# EAGLE schematic interaction_agronautes (EAGLE 6.1)
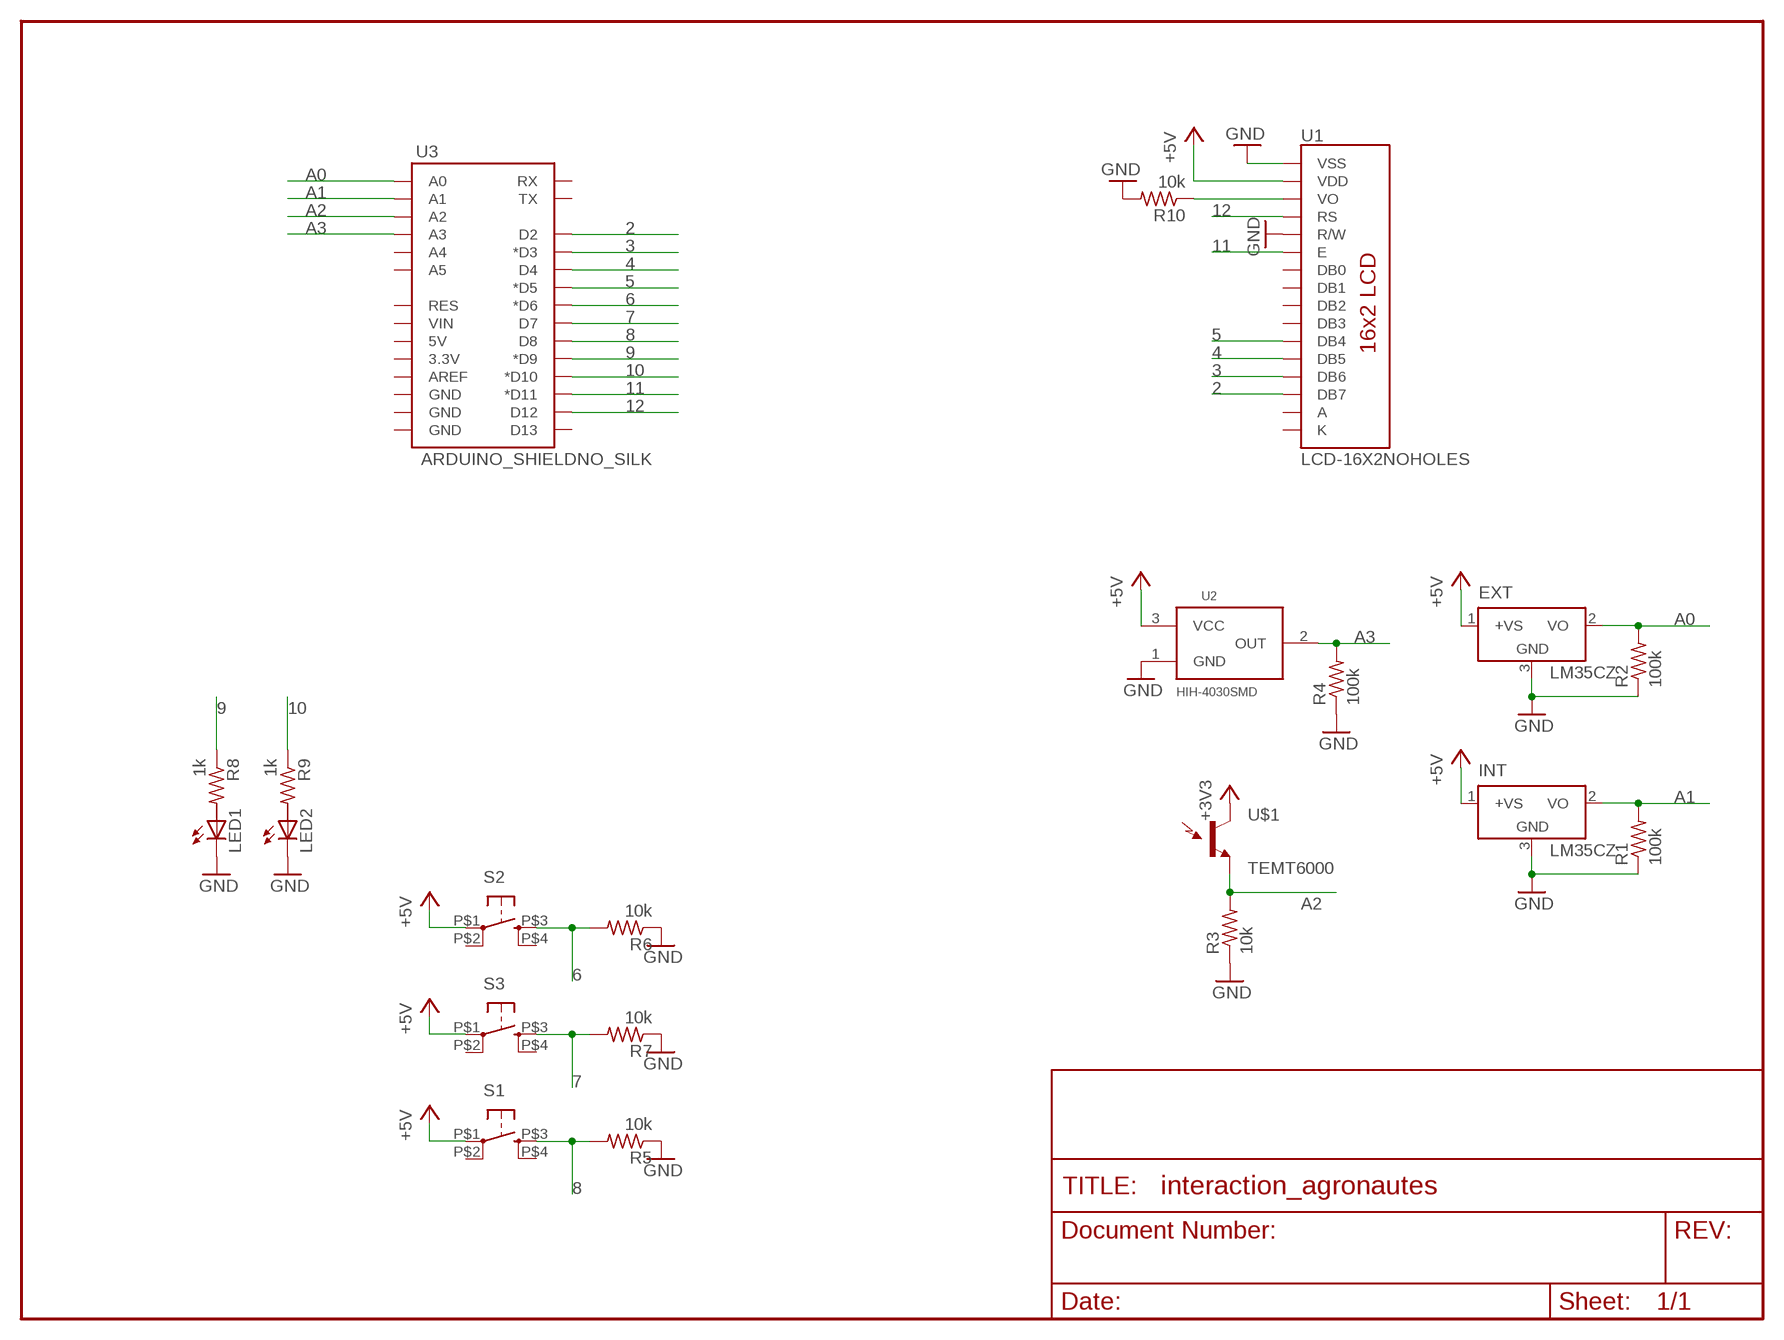
[diagram p0: schematic, sheet 1]

## Parts
EXT  LM35CZ  [TO92]
INT  LM35CZ  [TO92]
LED1  LED5MM  [LED5MM]
LED2  LED5MM  [LED5MM]
R1  100k  R-US_0204/7  [0204/7]
R2  100k  R-US_0204/7  [0204/7]
R3  10k  R-US_0204/7  [0204/7]
R4  100k  R-US_0204/7  [0204/7]
R5  10k  R-US_0204/7  [0204/7]
R6  10k  R-US_0204/7  [0204/7]
R7  10k  R-US_0204/7  [0204/7]
R8  1k  R-US_0204/7  [0204/7]
R9  1k  R-US_0204/7  [0204/7]
R10  10k  R-US_0204/7  [0204/7]
S1  TAC_SWITCHKSA_SEALED  [KSA_SEALED_TAC_SWITCH]
S2  TAC_SWITCHKSA_SEALED  [KSA_SEALED_TAC_SWITCH]
S3  TAC_SWITCHKSA_SEALED  [KSA_SEALED_TAC_SWITCH]
U1  LCD-16X2NOHOLES  [LCD-16X2_NOHOLES]
U2  HIH-4030SMD  [HIH-4030]
U3  ARDUINO_SHIELDNO_SILK  [DUEMILANOVE_VIAS]
U$1  TEMT6000  [TEMT6000-SEN]

## Nets
2: U1.14(DB7) U3.D2
3: U1.13(DB6) U3.D3(*D3)
4: U1.12(DB5) U3.D4
5: U1.11(DB4) U3.D5(*D5)
6: R6.2 S2.P$3 U3.D6(*D6)
7: R7.2 S3.P$3 U3.D7
8: R5.2 S1.P$3 U3.D8
9: R8.1 U3.D9(*D9)
10: R9.1 U3.D10(*D10)
11: U1.6(E) U3.D11(*D11)
12: U1.4(RS) U3.D12
+3V3: U$1.COLLECTOR(C1)
+5V: EXT.1(+VS) INT.1(+VS) S1.P$1 S2.P$1 S3.P$1 U1.2(VDD) U2.3(VCC)
A0: EXT.2(VO) R2.2 U3.A0
A1: INT.2(VO) R1.2 U3.A1
A2: R3.2 U3.A2 U$1.EMITTER(E1)
A3: R4.2 U2.2(OUT) U3.A3
GND: EXT.3(GND) INT.3(GND) LED1.K(C) LED2.K(C) R1.1 R2.1 R3.1 R4.1 R5.1 R6.1 R7.1 R10.2 U1.1(VSS) U1.5(R/W) U2.1(GND)
N$1: R10.1 U1.3(VO)
Unconnected: LED1.A LED2.A R8.2 R9.2 S1.P$2 S1.P$4 S2.P$2 S2.P$4 S3.P$2 S3.P$4 U1.7(DB0) U1.8(DB1) U1.9(DB2) U1.10(DB3) U3.3.3V U3.5V U3.A4 U3.A5 U3.AREF U3.D13 U3.GND@0(GND) U3.GND@1(GND) U3.GND@2(GND) U3.RES U3.RX U3.TX U3.VIN

## Power pins joined to a net without a drawn wire
A: U1.15(A)
K: U1.16(K)

## Library data of the parts
EXT INT = lm35:LM35: Single-Supply Centigrade Temperature Sensor Vout = (10mV/°C x Temp °C) +5mmmV Source: http://www.national.com/ds/LM/LM35.pdf
LED1 LED2 = led:LED: LED OSRAM: - CHIPLED LG R971, LG N971, LY N971, LG Q971, LY Q971, LO R971, LY R971 LH N974, LH R974 LS Q976, LO Q976, LY Q976 LO Q996 - Hyper CHIPLED LW Q18S LB Q993, LB Q99A, LB R99A - SideLED LS A670, LO A670, LY A670, LG A670, LP A670 LB A673, LV A673, LT A673, LW A673 LH A674 LY A675 LS A676, LA A676, LO A676, LY A676, LW A676 LS A679, LY A679, LG A679 - Hyper Micro SIDELED® LS Y876, LA Y876, LO Y876, LY Y876 LT Y87S - SmartLED LW L88C, LW L88S LB L89C, LB L89S, LG L890 LS L89K, LO L89K, LY L89K LS L896, LA L896, LO L896, LY L896 - TOPLED LS T670, LO T670, LY T670, LG T670, LP T670 LSG T670, LSP T670, LSY T670, LOP T670, LYG T670 LG T671, LOG T671, LSG T671 LB T673, LV T673, LT T673, LW T673 LH T674 LS T676, LA T676, LO T676, LY T676, LB T676, LH T676, LSB T676, LW T676 LB T67C, LV T67C, LT T67C, LS T67K, LO T67K, LY T67K, LW E67C LS E67B, LA E67B, LO E67B, LY E67B, LB E67C, LV E67C, LT E67C LW T67C LS T679, LY T679, LG T679 LS T770, LO T770, LY T770, LG T770, LP T770 LB T773, LV T773, LT T773, LW T773 LH T774 LS E675, LA E675, LY E675, LS T675 LS T776, LA T776, LO T776, LY T776, LB T776 LHGB T686 LT T68C, LB T68C - Hyper Mini TOPLED® LB M676 - Mini TOPLED Santana® LG M470 LS M47K, LO M47K, LY M47K Source: http://www.osram.convergy.de LUXEON: - LUMILED® LXK2-PW12-R00, LXK2-PW12-S00, LXK2-PW14-U00, LXK2-PW14-V00 LXK2-PM12-R00, LXK2-PM12-S00, LXK2-PM14-U00 LXK2-PE12-Q00, LXK2-PE12-R00, LXK2-PE12-S00, LXK2-PE14-T00, LXK2-PE14-U00 LXK2-PB12-K00, LXK2-PB12-L00, LXK2-PB12-M00, LXK2-PB14-N00, LXK2-PB14-P00, LXK2-PB14-Q00 LXK2-PR12-L00, LXK2-PR12-M00, LXK2-PR14-Q00, LXK2-PR14-R00 LXK2-PD12-Q00, LXK2-PD12-R00, LXK2-PD12-S00 LXK2-PH12-R00, LXK2-PH12-S00 LXK2-PL12-P00, LXK2-PL12-Q00, LXK2-PL12-R00 Source: www.luxeon.com KINGBRIGHT: KA-3528ASYC Source: www.kingbright.com
R1-R10 = resistor:R-US_: RESISTOR, American symbol
S1-S3 = SparkFun-Electromechanical:TAC_SWITCH: Momentary Switch Button commonly used for reset or general input. Spark Fun Electronics SKU : COM-00097
U1 = SparkFun-Displays:LCD-16X2: Standard text-only 16x2 parallel input LCD
U2 = SparkFunv1:HIH-4030: Humidity Sensor
U3 = SparkFun-Boards:ARDUINO_SHIELD: Arduino shield footprint
U$1 = SparkFunv1:TEMT6000: Ambient Light Sensor Simple light detection sensor. Output varies with light intensity input. Spark Fun Electronics SKU : COM-08348